# Altium schematic sheet PAGE1 - CONTENT.SchDoc
size A3; DocumentNumber: 1; SheetNumber: 1; SheetTotal: 2
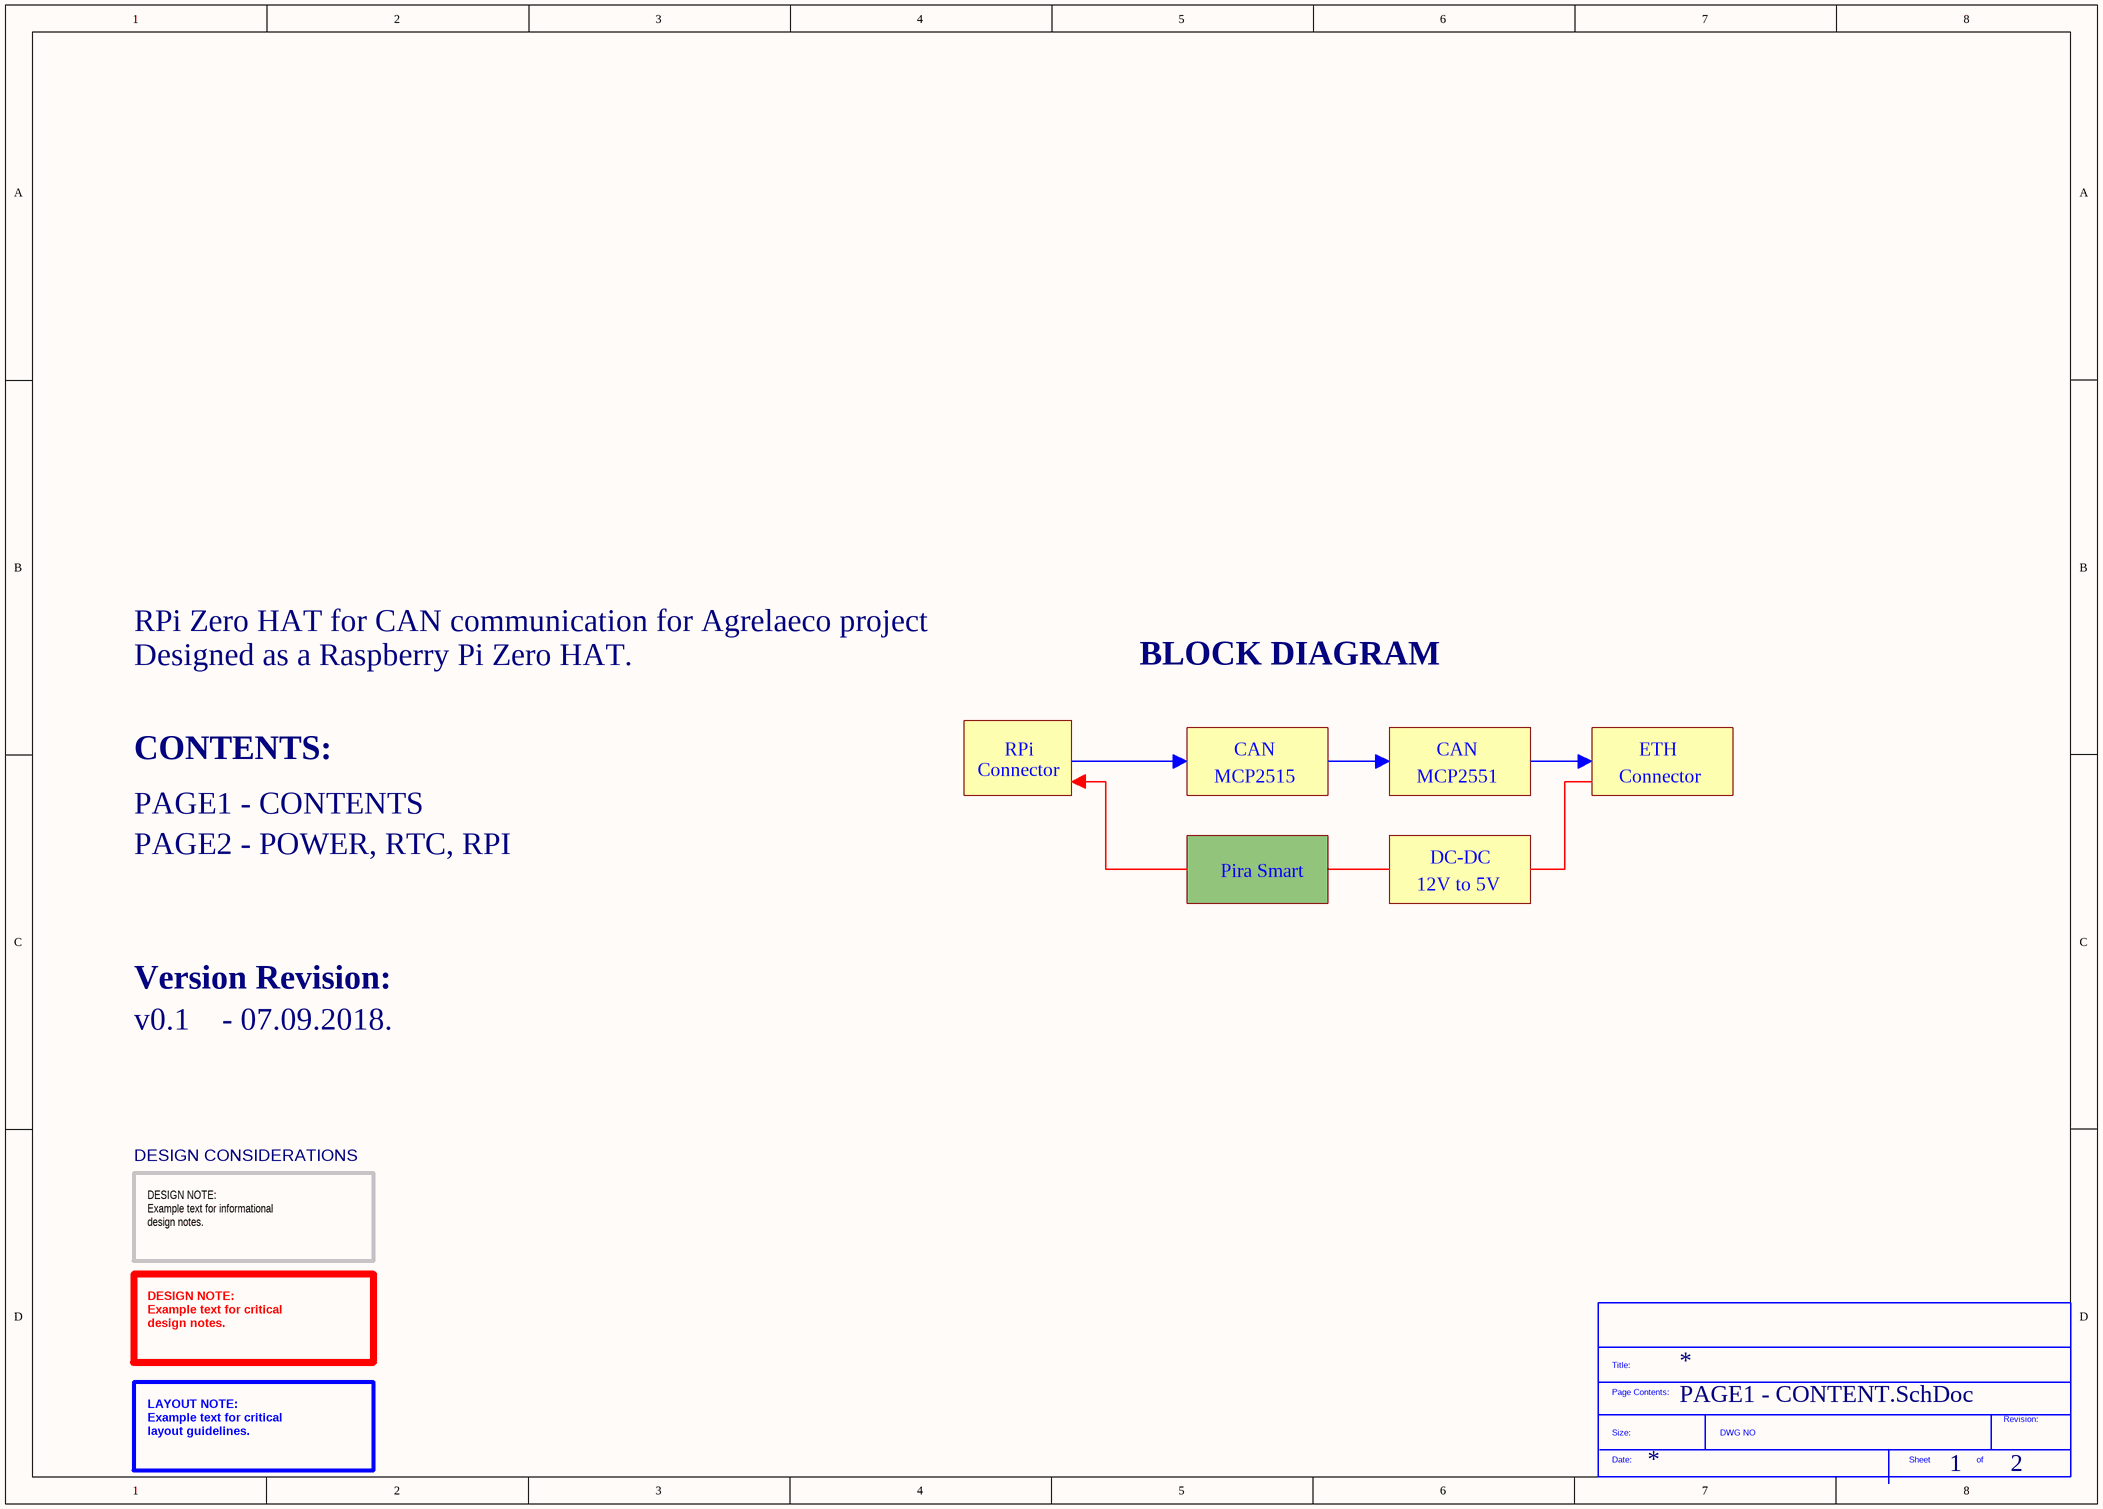
[diagram p0: PAGE1 - CONTENT.SchDoc]

## Parts
*?  SDTitleBlock  (value not drawn)  (graphical)

## Notes on the sheet
- RPi Zero HAT for CAN communication for Agrelaeco project
- Designed as a Raspberry Pi Zero HAT.
- BLOCK DIAGRAM
- CONTENTS:
- Connector
- RPi
- MCP2515
- CAN
- MCP2551
- ETH
- PAGE1 - CONTENTS
- PAGE2 - POWER, RTC, RPI
- Pira Smart
- 12V to 5V
- DC-DC
- Version Revision:
- v0.1    - 07.09.2018.
- DESIGN CONSIDERATIONS
- DESIGN NOTE:
  Example text for informational
  design notes.
- DESIGN NOTE:
  Example text for critical
  design notes.
- LAYOUT NOTE:
  Example text for critical
  layout guidelines.
- (in symbol SDTitleBlock) Title:; Page Contents:; Revision:; Size:; DWG NO; Date:; Sheet; of